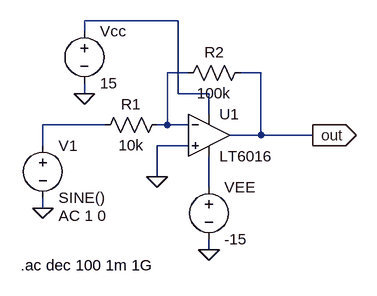
[diagram p0: schematic inverting_amp.asc]
inverting_amp.asc, the LTspice schematic file:
Version 4
SHEET 1 880 680
WIRE 144 0 0 0
WIRE 0 16 0 0
WIRE 160 80 128 80
WIRE 272 80 240 80
WIRE 0 112 0 96
WIRE 144 112 144 0
WIRE 192 112 144 112
WIRE 192 144 192 112
WIRE 32 160 -64 160
WIRE 128 160 128 80
WIRE 128 160 112 160
WIRE 160 160 128 160
WIRE 272 176 272 80
WIRE 272 176 224 176
WIRE 352 176 272 176
WIRE -64 192 -64 160
WIRE 160 192 112 192
WIRE 112 240 112 192
WIRE 192 256 192 208
WIRE -64 288 -64 272
WIRE 192 352 192 336
FLAG 112 240 0
FLAG -64 288 0
FLAG 352 176 out
IOPIN 352 176 Out
FLAG 192 352 0
FLAG 0 112 0
SYMBOL OpAmps\\LT6016 192 176 R0
SYMATTR InstName U1
SYMBOL res 128 144 R90
WINDOW 0 0 56 VBottom 2
WINDOW 3 32 56 VTop 2
SYMATTR InstName R1
SYMATTR Value 10k
SYMBOL res 256 64 R90
WINDOW 0 0 56 VBottom 2
WINDOW 3 32 56 VTop 2
SYMATTR InstName R2
SYMATTR Value 100k
SYMBOL voltage -64 176 R0
WINDOW 123 24 124 Left 2
WINDOW 39 0 0 Left 0
SYMATTR InstName V1
SYMATTR Value SINE()
SYMATTR Value2 AC 1 0
SYMBOL voltage 0 0 R0
WINDOW 123 0 0 Left 0
WINDOW 39 0 0 Left 0
SYMATTR InstName Vcc
SYMATTR Value 15
SYMBOL voltage 192 240 R0
WINDOW 123 0 0 Left 0
WINDOW 39 0 0 Left 0
SYMATTR InstName VEE
SYMATTR Value -15
TEXT -98 376 Left 2 !.ac dec 100 1m 1G

The netlist it stands for:
* inverting_amp.asc
* U1: LT6016 (symbol OpAmps\LT6016 not available, pins judged from their places): In+=0 In-=N002 V+=N001 V-=N004 OUT=out
R1 N002 N003 10k
R2 out N002 100k
V1 N003 0 SINE() AC 1 0
Vcc N001 0 15
VEE N004 0 -15
.ac dec 100 1m 1G
.backanno
.end